# Altium schematic sheet Out.SchDoc
size A4; SheetNumber: 5; SheetTotal: 5
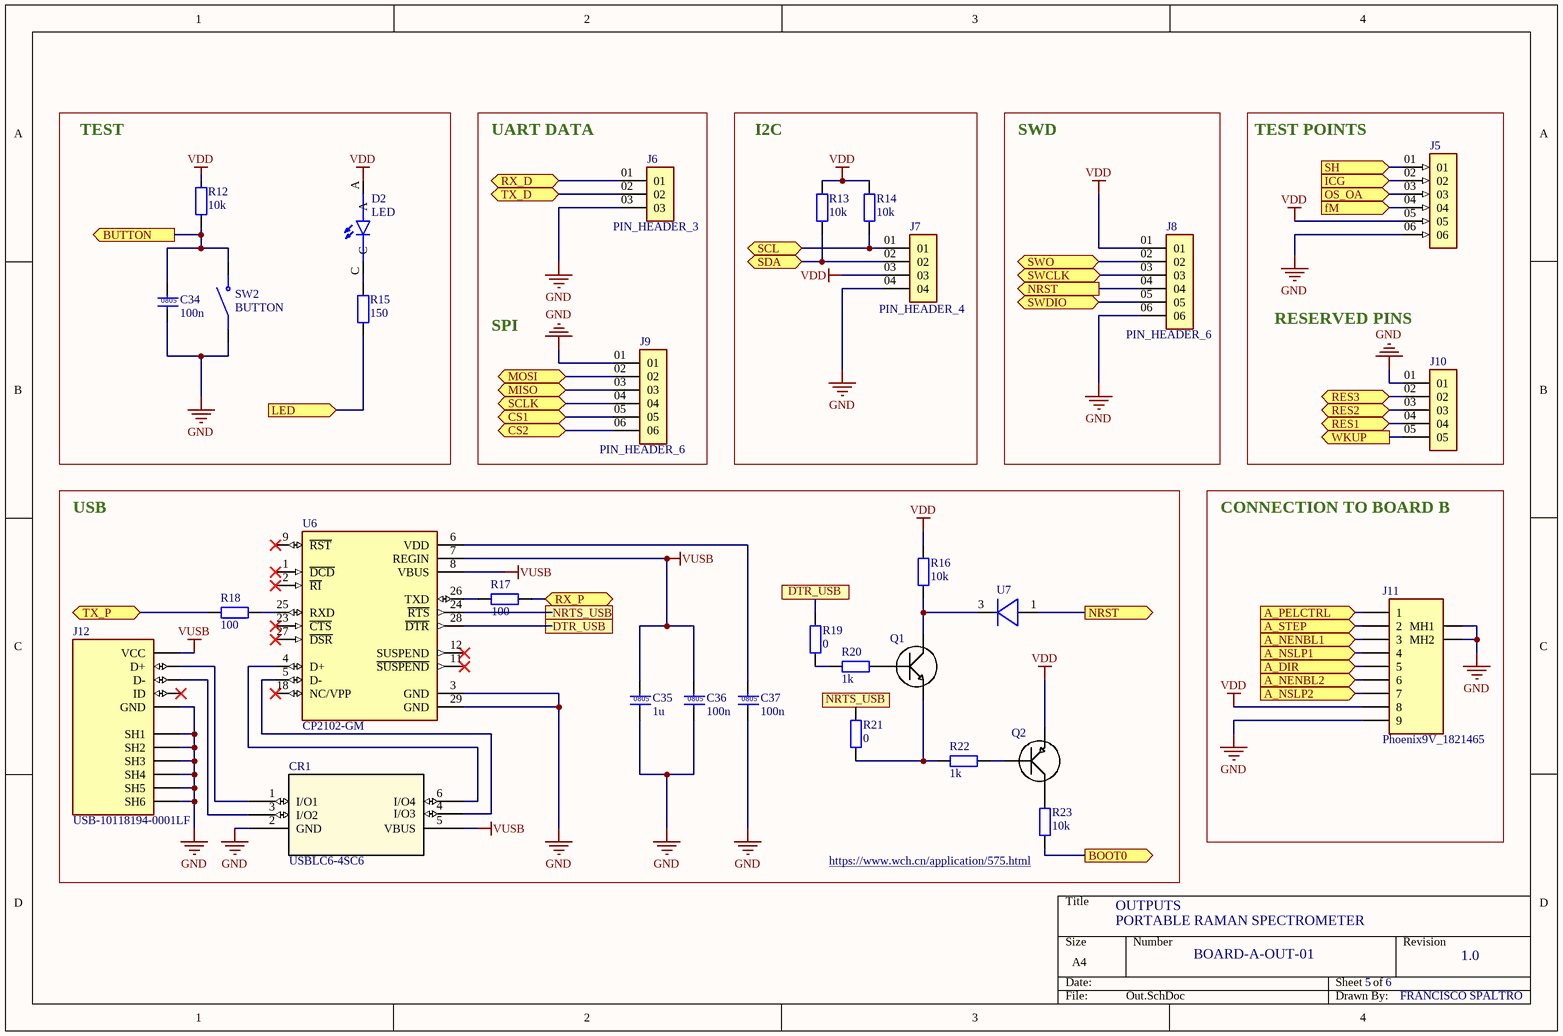
[diagram p0: Out.SchDoc]

## Parts
C34  100n  [RES_0805]
C35  1u  [RES_0805]
C36  100n  [RES_0805]
C37  100n  [RES_0805]
CR1  USBLC6-4SC6  [SOT23-6L_STM-M]
D2  LED  [LEDC1608X35N]
J5  PIN_HEADER_6  [GEN_PIN6]  (value not drawn)
J6  PIN_HEADER_3  [GEN_PIN3]
J7  PIN_HEADER_4  [GEN_PIN4]
J8  PIN_HEADER_6  [GEN_PIN6]
J9  PIN_HEADER_6  [GEN_PIN6]
J10  PIN_HEADER_5  [GEN_PIN5]  (value not drawn)
J11  Phoenix9V_1821465  [PHOENIX_1821465]
J12  USB-10118194-0001LF  [AMPHENOL_10118194-0001LF]
Q1  BC846BLT1G  [SOT-23_ONS-M]  (value not drawn)
Q2  BC857B-AQ  [SOT95P240X120-3N]  (value not drawn)
R12  10k  [RES_0805]
R13  10k  [RES_0805]
R14  10k  [RES_0805]
R15  150  [RES_0805]
R16  10k  [RES_0805]
R17  100  [RES_0805]
R18  100  [RES_0805]
R19  0  [RES_0805]
R20  1k  [RES_0805]
R21  0  [RES_0805]
R22  1k  [RES_0805]
R23  10k  [RES_0805]
SW2  BUTTON  [SW_B3U-1000P]
U6  CP2102-GM  [QFN50P500X500X100-29N]
U7  BAS40-7-F  [SOT-23_DIO-M]  (value not drawn)

## Blocks framed on the sheet
TEST: C34 D2 R12 R15 SW2
I2C: J7 R13 R14
SWD: J8
USB: C35-C37 CR1 J12 Q1 Q2 R16-R23 U6 U7
CONNECTION TO BOARD B: J11

## Ports
A_DIR (in, see Main[3A], Microcontroller[3C]), A_NENBL1 (in, see Main[3B], Microcontroller[2C]), A_NENBL2 (in, see Main[3B], Microcontroller[3C]), A_NSLP1 (in, see Main[3B], Microcontroller[2C]), A_NSLP2 (in, see Main[3B], Microcontroller[3C]), A_PELCTRL (in, see Main[3B], Microcontroller[3B]), A_STEP (in, see Main[3B], Microcontroller[3B]), BOOT0 (out, see Main[2B], Microcontroller[2A]), BUTTON (out, see Main[2C], Microcontroller[2C]), CS1 (bidir, see Main[2B], Microcontroller[3B]), CS2 (bidir, see Main[2B], Microcontroller[2B]), fM (in, see Main[3C], Microcontroller[2B], Sensor[2A]), ICG (in, see Main[3C], Microcontroller[2B], Sensor[2A]), LED (in, see Main[2B], Microcontroller[3B]), MISO (bidir, see Main[2B], Microcontroller[3B]), MOSI (bidir, see Main[2B], Microcontroller[3B]), NRST (out, see Main[2B], Microcontroller[2A]), OS_OA (in, see Main[3C], Microcontroller[1B], Sensor[4B]), RES1 (bidir, see Main[2C], Microcontroller[3B]), RES2 (bidir, see Main[2C], Microcontroller[2C]), RES3 (bidir, see Main[2C], Microcontroller[3B]), RX_D (bidir, see Main[2A], Microcontroller[3B]), RX_P (bidir, see Main[2B], Microcontroller[2B]), SCL (bidir, see Main[2A], Microcontroller[2B], Sensor[1C]), SCLK (bidir, see Main[2B], Microcontroller[3B]), SDA (bidir, see Main[2A], Microcontroller[3C], Sensor[1C]), SH (in, see Main[3C], Microcontroller[2B], Sensor[2A]), SWCLK (bidir, see Main[2B], Microcontroller[2B]), SWDIO (bidir, see Main[2B], Microcontroller[2B]), SWO (bidir, see Main[2B], Microcontroller[2C]), TX_D (bidir, see Main[2A], Microcontroller[3B]), TX_P (bidir, see Main[2B], Microcontroller[2B]), WKUP (out, see Main[2B], Microcontroller[2B])

## Nets
GND: C34.2 C35.2 C36.2 C37.2 CR1.2(GND) J5.06 J6.03 J7.04 J8.06 J9.01 J10.01 J11.9 J11.MH1 J11.MH2 J12.5(GND) J12.SH1 J12.SH2 J12.SH3 J12.SH4 J12.SH5 J12.SH6 SW2.1 U6.3(GND) U6.29(GND)
VDD: D2.A J5.05 J7.03 J8.01 J11.8 Q2.2(E) R12.2 R13.2 R14.2 R16.2
VUSB: C35.1 C36.1 CR1.5(VBUS) J12.1(VCC) U6.7(REGIN) U6.8(VBUS)
A_DIR: J11.5 ; port A_DIR
A_NENBL1: J11.3 ; port A_NENBL1
A_NENBL2: J11.6 ; port A_NENBL2
A_NSLP1: J11.4 ; port A_NSLP1
A_NSLP2: J11.7 ; port A_NSLP2
A_PELCTRL: J11.1 ; port A_PELCTRL
A_STEP: J11.2 ; port A_STEP
BOOT0: R23.1 ; port BOOT0
BUTTON: C34.1 R12.1 SW2.2 ; port BUTTON
CS1: J9.05 ; port CS1
CS2: J9.06 ; port CS2
DTR_USB: R19.2 U6.28(~{DTR})
fM: J5.04 ; port fM
ICG: J5.02 ; port ICG
LED: R15.1 ; port LED
MISO: J9.03 ; port MISO
MOSI: J9.02 ; port MOSI
NRST: J8.04 U7.1(A) ; port NRST
NRTS_USB: R21.2 U6.24(~{RTS})
OS_OA: J5.03 ; port OS_OA
RES1: J10.04 ; port RES1
RES2: J10.03 ; port RES2
RES3: J10.02 ; port RES3
RX_D: J6.01 ; port RX_D
RX_P: R17.2 ; port RX_P
SCL: J7.01 R14.1 ; port SCL
SCLK: J9.04 ; port SCLK
SDA: J7.02 R13.1 ; port SDA
SH: J5.01 ; port SH
SWCLK: J8.03 ; port SWCLK
SWDIO: J8.05 ; port SWDIO
SWO: J8.02 ; port SWO
TX_D: J6.02 ; port TX_D
TX_P: R18.1 ; port TX_P
WKUP: J10.05 ; port WKUP
NetC37_1: C37.1 U6.6(VDD)
NetCR1_1: CR1.1(I/O1) J12.3(D+)
NetCR1_3: CR1.3(I/O2) J12.2(D-)
NetCR1_4: CR1.4(I/O3) U6.5(D-)
NetCR1_6: CR1.6(I/O4) U6.4(D+)
NetD2_C: D2.C R15.2
NetQ1_1: Q1.1(B) R20.2
NetQ1_2: Q1.2(E) R21.1 R22.1
NetQ1_3: Q1.3(C) R16.1 U7.3(C)
NetQ2_1: Q2.1(B) R22.2
NetQ2_3: Q2.3(C) R23.2
NetR17_1: R17.1 U6.26(TXD)
NetR18_2: R18.2 U6.25(RXD)
NetR19_1: R19.1 R20.1

Not connected (* = marked no-connect by the designer): J12 4(ID)*; U6 1(~{DCD})* 2(~{RI})* 9(~{RST})* 11(~{SUSPEND})* 12(SUSPEND)* 18(NC/VPP)* 23(~{CTS})* 27(~{DSR})*

## Notes on the sheet
- UART DATA
- TEST POINTS
- SPI
- RESERVED PINS
- (near R23) https://www.wch.cn/application/575.html
- OUTPUTS
- PORTABLE RAMAN SPECTROMETER
- BOARD-A-OUT-01
- 5
- 6
- 1.0
- FRANCISCO SPALTRO
- (in symbol CAP_0805) 0805

## Library data of the parts
C34 C36 C37 = CAP_0805: Kemet C0805C104K3RAC7800
C35 = CAP_0805: Yageo CC0805KKX7R7BB105
CR1 = USBLC6-4SC6: Very low capacitance ESD protection; Manufacturer_Name: STMicroelectronics; Copyright: Copyright (C) 2025 Ultra Librarian. All rights reserved.; Manufacturer_Part_Number: USBLC6-4SC6; RefDes: RefDes; Type: Type
D2 = LED-LTST-C190KRKT: Red 631nm LED Indication - Discrete 2V 0603 (1608 Metric); MF: Lite-On Inc.; Check_prices: https://www.snapeda.com/parts/LTST-C190KRKT/Lite-On+Inc./view-part/?ref=eda; Value: *; Purchase-URL: https://pricing.snapeda.com/search/part/LTST-C190KRKT/?ref=eda; Price: None; MP: LTST-C190KRKT; SnapEDA_Link: https://www.snapeda.com/parts/LTST-C190KRKT/Lite-On+Inc./view-part/?ref=snap; Availability: In Stock; Package: 0603 Lite-On
J5 J8 J9 = PIN_HEADER_6: Generic 40 mils drill size, 100 mils step; MF: Samtec Inc.; MP: TS-106-T-A; SnapEDA_Link: https://www.snapeda.com/parts/TS-106-T-A/Samtec+Inc./view-part/?ref=snap; Package: None; Value: *; Check_prices: https://www.snapeda.com/parts/TS-106-T-A/Samtec+Inc./view-part/?ref=eda
J6 = PIN_HEADER_3: Generic 40 mils drill size, 100 mils step; MF: Samtec Inc.; MP: TS-103-T-A; SnapEDA_Link: https://www.snapeda.com/parts/TS-103-T-A/Samtec+Inc./view-part/?ref=snap; Package: None; Value: *; Check_prices: https://www.snapeda.com/parts/TS-103-T-A/Samtec+Inc./view-part/?ref=eda
J7 = PIN_HEADER_4: Generic 40 mils drill size, 100 mils step; MF: Samtec Inc.; MP: TS-104-T-A; Check_prices: https://www.snapeda.com/parts/TS-104-T-A/Samtec+Inc./view-part/?ref=eda; Value: *; Availability: In Stock; Price: None; Package: None; SnapEDA_Link: https://www.snapeda.com/parts/TS-104-T-A/Samtec+Inc./view-part/?ref=snap; Purchase-URL: https://pricing.snapeda.com/search/part/TS-104-T-A/?ref=eda
J10 = PIN_HEADER_5: Generic 40 mils drill size, 100 mils step; MF: Samtec Inc.; MP: TS-105-T-A; Package: None; Check_prices: https://www.snapeda.com/parts/TS-105-T-A/Samtec+Inc./view-part/?ref=eda; Availability: In Stock; Value: *; Purchase-URL: https://pricing.snapeda.com/search/part/TS-105-T-A/?ref=eda; Price: None; SnapEDA_Link: https://www.snapeda.com/parts/TS-105-T-A/Samtec+Inc./view-part/?ref=snap
J11 = Phoenix9V_1821465: MF: {'manufacturer': u'Phoenix Contact'}; Package: None; Price: None; Value: *; MP: 1821465; Availability: Unavailable
J12 = USB-10118194-0001LF: Micro USB, Input Output Connectors, B TYPE RECEPTACLE with flange; MF: Amphenol ICC; SnapEDA_Link: https://www.snapeda.com/parts/10118194-0001LF/Amphenol+FCI/view-part/?ref=snap; Package: None; Value: *; MP: 10118194-0001LF; Check_prices: https://www.snapeda.com/parts/10118194-0001LF/Amphenol+FCI/view-part/?ref=eda
Q1 = BC846BLT1G: Description; Manufacturer_Name: onsemi; Copyright: Copyright (C) 2025 Ultra Librarian. All rights reserved.; Manufacturer_Part_Number: BC846BLT1G; RefDes: RefDes; Type: Type
Q2 = BC857B-AQ: MF: {'manufacturer': u'Diotec Semiconductor'}; Package: None; Price: None; Value: *; MP: BC857B-AQ; Availability: Unavailable
R12-R23 = RES_0805: Generic Capacitor
SW2 = SW-B3U-1000P: Switch Tactile N.O. SPST Round Button Gull Wing 0.05A 12VDC 1.5N SMD Embossed T/R; Price: None; MP: B3U-1000P; Availability: Unavailable; Value: *; Package: None
U6 = CP2102-GM: USB Bridge, USB to UART USB 2.0 UART Interface 28-QFN (5x5); MF: Silicon Labs; SnapEDA_Link: https://www.snapeda.com/parts/CP2102-GM/Silicon+Labs/view-part/?ref=snap; Package: QFN-28 Silicon Labs; Value: *; MP: CP2102-GM; Check_prices: https://www.snapeda.com/parts/CP2102-GM/Silicon+Labs/view-part/?ref=eda
U7 = DIODE-BAS40-7-F: Description; Manufacturer_Name: Diodes Inc; Type: Diodes - Rectifiers, Single; Copyright: Copyright (C) 2025 Ultra Librarian. All rights reserved.; Manufacturer_Part_Number: BAS40-7-F; RefDes: RefDes